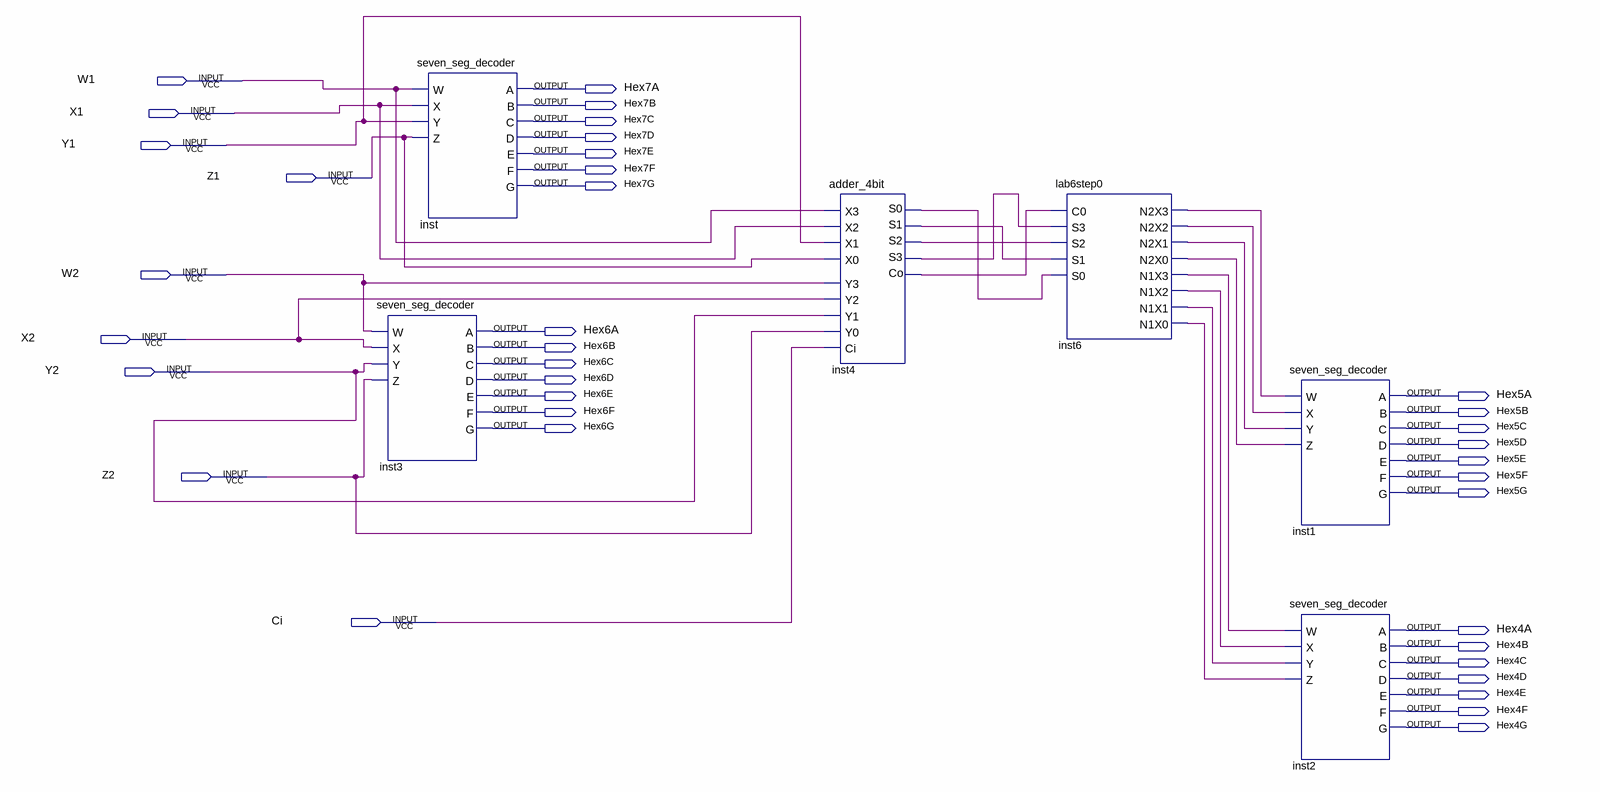
[diagram p0: schematic sheet]
// Quartus schematic lab6step1.bdf as structural Verilog: 6 symbols, 37 pins
module lab6step1 (
  input  W1,
  input  X1,
  input  Y1,
  input  Z1,
  input  W2,
  input  X2,
  input  Y2,
  input  Z2,
  input  Ci,
  output Hex7A,
  output Hex7B,
  output Hex7C,
  output Hex7D,
  output Hex7E,
  output Hex7F,
  output Hex7G,
  output Hex6A,
  output Hex6B,
  output Hex6C,
  output Hex6D,
  output Hex6E,
  output Hex5A,
  output Hex6F,
  output Hex5B,
  output Hex6G,
  output Hex5C,
  output Hex5D,
  output Hex5E,
  output Hex5F,
  output Hex5G,
  output Hex4A,
  output Hex4B,
  output Hex4C,
  output Hex4D,
  output Hex4E,
  output Hex4F,
  output Hex4G
);

  wire inst4_co, inst4_s0, inst4_s1, inst4_s2, inst4_s3, inst6_n1x0, inst6_n1x1, inst6_n1x2, inst6_n1x3,
       inst6_n2x0, inst6_n2x1, inst6_n2x2, inst6_n2x3;

  seven_seg_decoder inst (
    .W(W1), .X(X1), .Y(Y1), .Z(Z1), .A(Hex7A), .B(Hex7B), .C(Hex7C), .D(Hex7D), .E(Hex7E), .F(Hex7F),
    .G(Hex7G));
  seven_seg_decoder inst3 (
    .W(W2), .X(X2), .Y(Y2), .Z(Z2), .A(Hex6A), .B(Hex6B), .C(Hex6C), .D(Hex6D), .E(Hex6E), .F(Hex6F),
    .G(Hex6G));
  adder_4bit inst4 (
    .X3(W1), .Y3(W2), .X2(X1), .Y2(X2), .X1(Y1), .Y1(Y2), .X0(Z1), .Y0(Z2), .Ci(Ci), .S0(inst4_s0),
    .S1(inst4_s1), .S2(inst4_s2), .S3(inst4_s3), .Co(inst4_co));
  lab6step0 inst6 (
    .C0(inst4_co), .S3(inst4_s3), .S2(inst4_s2), .S1(inst4_s1), .S0(inst4_s0), .N2X3(inst6_n2x3),
    .N2X2(inst6_n2x2), .N2X1(inst6_n2x1), .N2X0(inst6_n2x0), .N1X3(inst6_n1x3), .N1X2(inst6_n1x2),
    .N1X1(inst6_n1x1), .N1X0(inst6_n1x0));
  seven_seg_decoder inst1 (
    .W(inst6_n2x3), .X(inst6_n2x2), .Y(inst6_n2x1), .Z(inst6_n2x0), .A(Hex5A), .B(Hex5B), .C(Hex5C),
    .D(Hex5D), .E(Hex5E), .F(Hex5F), .G(Hex5G));
  seven_seg_decoder inst2 (
    .W(inst6_n1x3), .X(inst6_n1x2), .Y(inst6_n1x1), .Z(inst6_n1x0), .A(Hex4A), .B(Hex4B), .C(Hex4C),
    .D(Hex4D), .E(Hex4E), .F(Hex4F), .G(Hex4G));
endmodule
